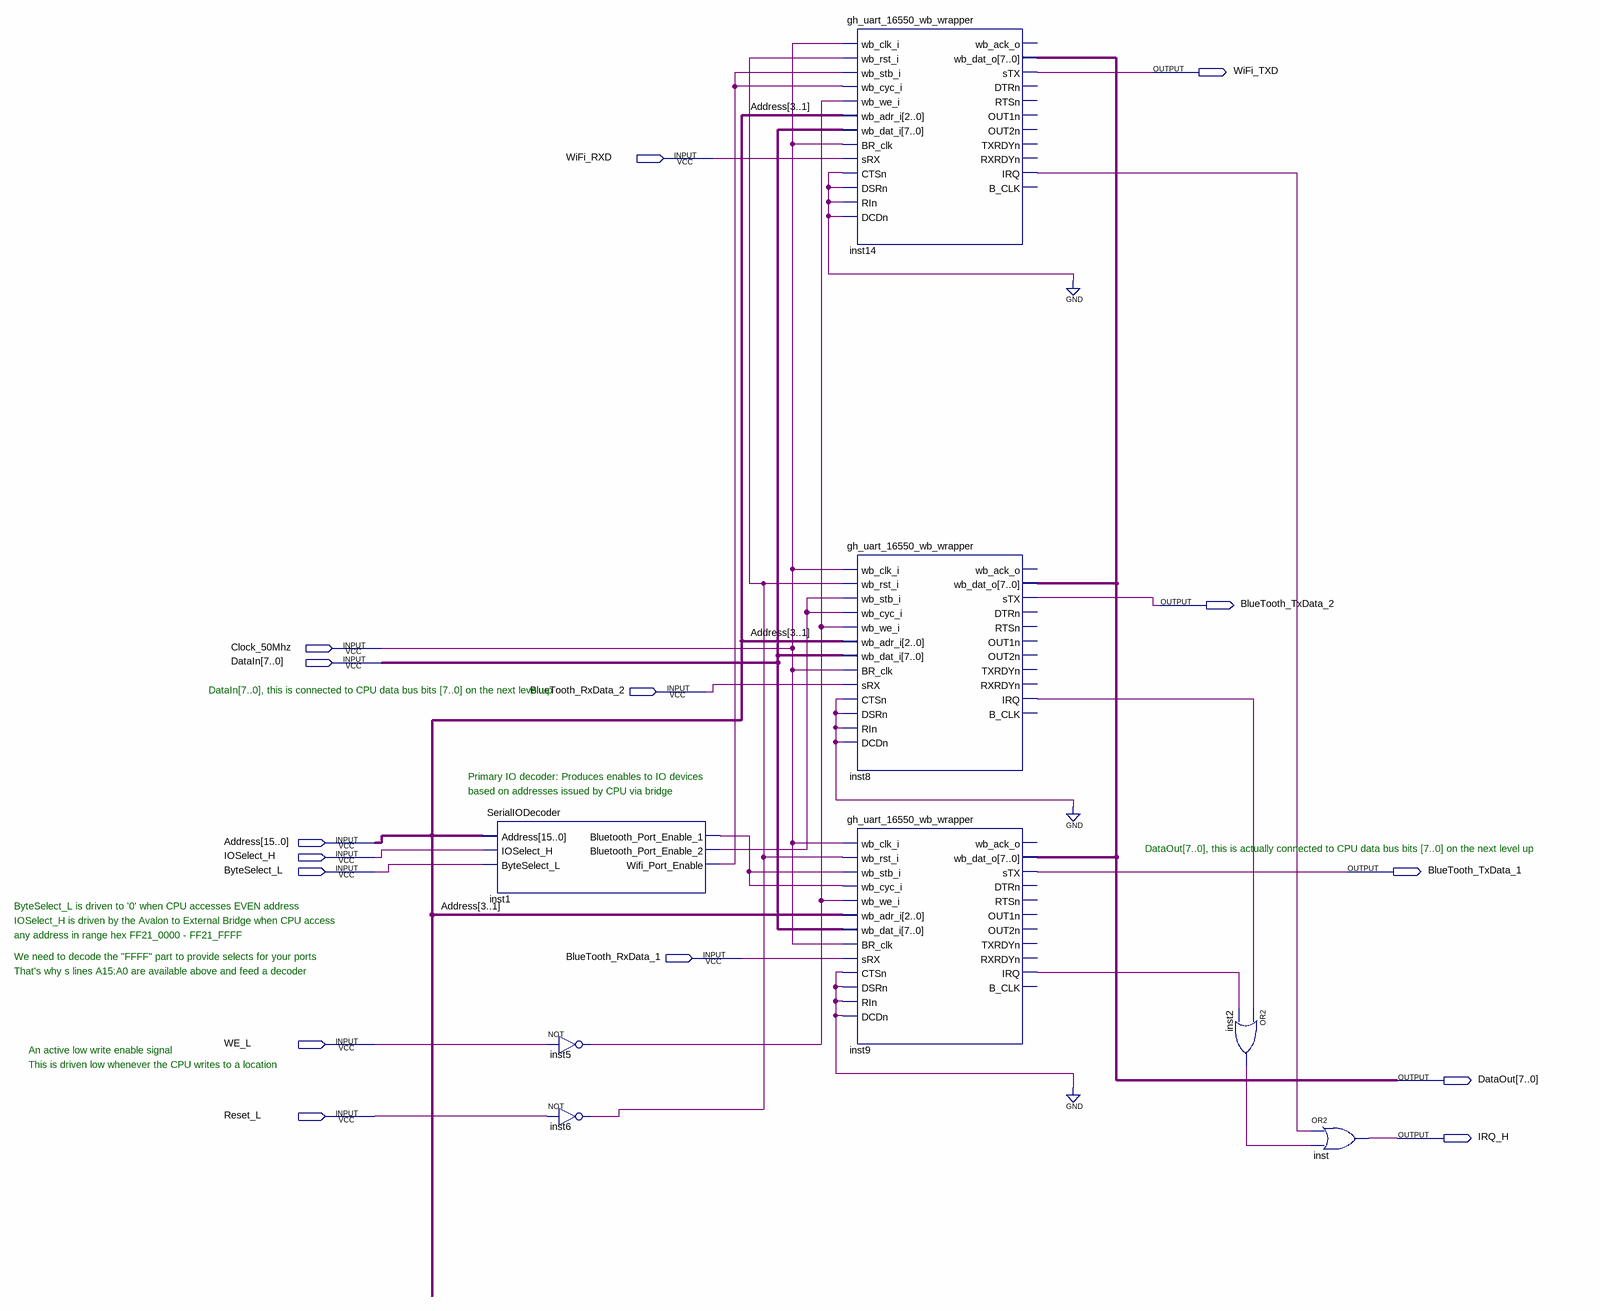
[diagram p0: schematic sheet]
// Quartus schematic OnChipSerialIO.bdf as structural Verilog: 8 symbols, 15 pins
module OnChipSerialIO (
  input  WiFi_RXD,
  input  Clock_50Mhz,
  input  [7:0] DataIn,
  input  BlueTooth_RxData_2,
  input  [15:0] Address,
  input  IOSelect_H,
  input  ByteSelect_L,
  input  BlueTooth_RxData_1,
  input  WE_L,
  input  Reset_L,
  output WiFi_TXD,
  output BlueTooth_TxData_2,
  output BlueTooth_TxData_1,
  output [7:0] DataOut,
  output IRQ_H
);

  wire inst1_bluetooth_port_enable_1, inst1_bluetooth_port_enable_2, inst1_wifi_port_enable, inst2_out,
       inst5_out, inst6_out, inst8_irq, inst9_irq, inst14_irq;

  SerialIODecoder inst1 (
    .Address(Address), .IOSelect_H(IOSelect_H), .ByteSelect_L(ByteSelect_L),
    .Bluetooth_Port_Enable_1(inst1_bluetooth_port_enable_1),
    .Bluetooth_Port_Enable_2(inst1_bluetooth_port_enable_2), .Wifi_Port_Enable(inst1_wifi_port_enable));
  not inst5 (inst5_out, WE_L);
  not inst6 (inst6_out, Reset_L);
  gh_uart_16550_wb_wrapper inst14 (
    .wb_clk_i(Clock_50Mhz), .wb_rst_i(inst6_out), .wb_stb_i(inst1_wifi_port_enable),
    .wb_cyc_i(inst1_wifi_port_enable), .wb_we_i(inst5_out), .wb_adr_i(Address[3:1]), .wb_dat_i(DataIn),
    .BR_clk(Clock_50Mhz), .sRX(WiFi_RXD), .CTSn(1'b0), .DSRn(1'b0), .RIn(1'b0), .DCDn(1'b0),
    .wb_dat_o(DataOut), .sTX(WiFi_TXD), .IRQ(inst14_irq));  // open: wb_ack_o, DTRn, RTSn, OUT1n, OUT2n, TXRDYn, RXRDYn, B_CLK
  gh_uart_16550_wb_wrapper inst8 (
    .wb_clk_i(Clock_50Mhz), .wb_rst_i(inst6_out), .wb_stb_i(inst1_bluetooth_port_enable_2),
    .wb_cyc_i(inst1_bluetooth_port_enable_2), .wb_we_i(inst5_out), .wb_adr_i(Address[3:1]),
    .wb_dat_i(DataIn), .BR_clk(Clock_50Mhz), .sRX(BlueTooth_RxData_2), .CTSn(1'b0), .DSRn(1'b0), .RIn(1'b0),
    .DCDn(1'b0), .wb_dat_o(DataOut), .sTX(BlueTooth_TxData_2), .IRQ(inst8_irq));  // open: wb_ack_o, DTRn, RTSn, OUT1n, OUT2n, TXRDYn, RXRDYn, B_CLK
  gh_uart_16550_wb_wrapper inst9 (
    .wb_clk_i(Clock_50Mhz), .wb_rst_i(inst6_out), .wb_stb_i(inst1_bluetooth_port_enable_1),
    .wb_cyc_i(inst1_bluetooth_port_enable_1), .wb_we_i(inst5_out), .wb_adr_i(Address[3:1]),
    .wb_dat_i(DataIn), .BR_clk(Clock_50Mhz), .sRX(BlueTooth_RxData_1), .CTSn(1'b0), .DSRn(1'b0), .RIn(1'b0),
    .DCDn(1'b0), .wb_dat_o(DataOut), .sTX(BlueTooth_TxData_1), .IRQ(inst9_irq));  // open: wb_ack_o, DTRn, RTSn, OUT1n, OUT2n, TXRDYn, RXRDYn, B_CLK
  or inst2 (inst2_out, inst8_irq, inst9_irq);
  or inst (IRQ_H, inst14_irq, inst2_out);

  // Notes on the sheet:
  //   DataIn[7..0], this is connected to CPU data bus bits [7..0] on the next level up
  //   Primary IO decoder: Produces enables to IO devices
  //   based on addresses issued by CPU via bridge
  //   DataOut[7..0], this is actually connected to CPU data bus bits [7..0] on the next level up
  //   ByteSelect_L is driven to '0' when CPU accesses EVEN address
  //   IOSelect_H is driven by the Avalon to External Bridge when CPU access
  //   any address in range hex FF21_0000 - FF21_FFFF
  //   We need to decode the "FFFF" part to provide selects for your ports 
  //   That's why s lines A15:A0 are available above and feed a decoder
  //   An active low write enable signal
  //   This is driven low whenever the CPU writes to a location
endmodule
